# Altium schematic sheet power2pix.SchDoc
size A4
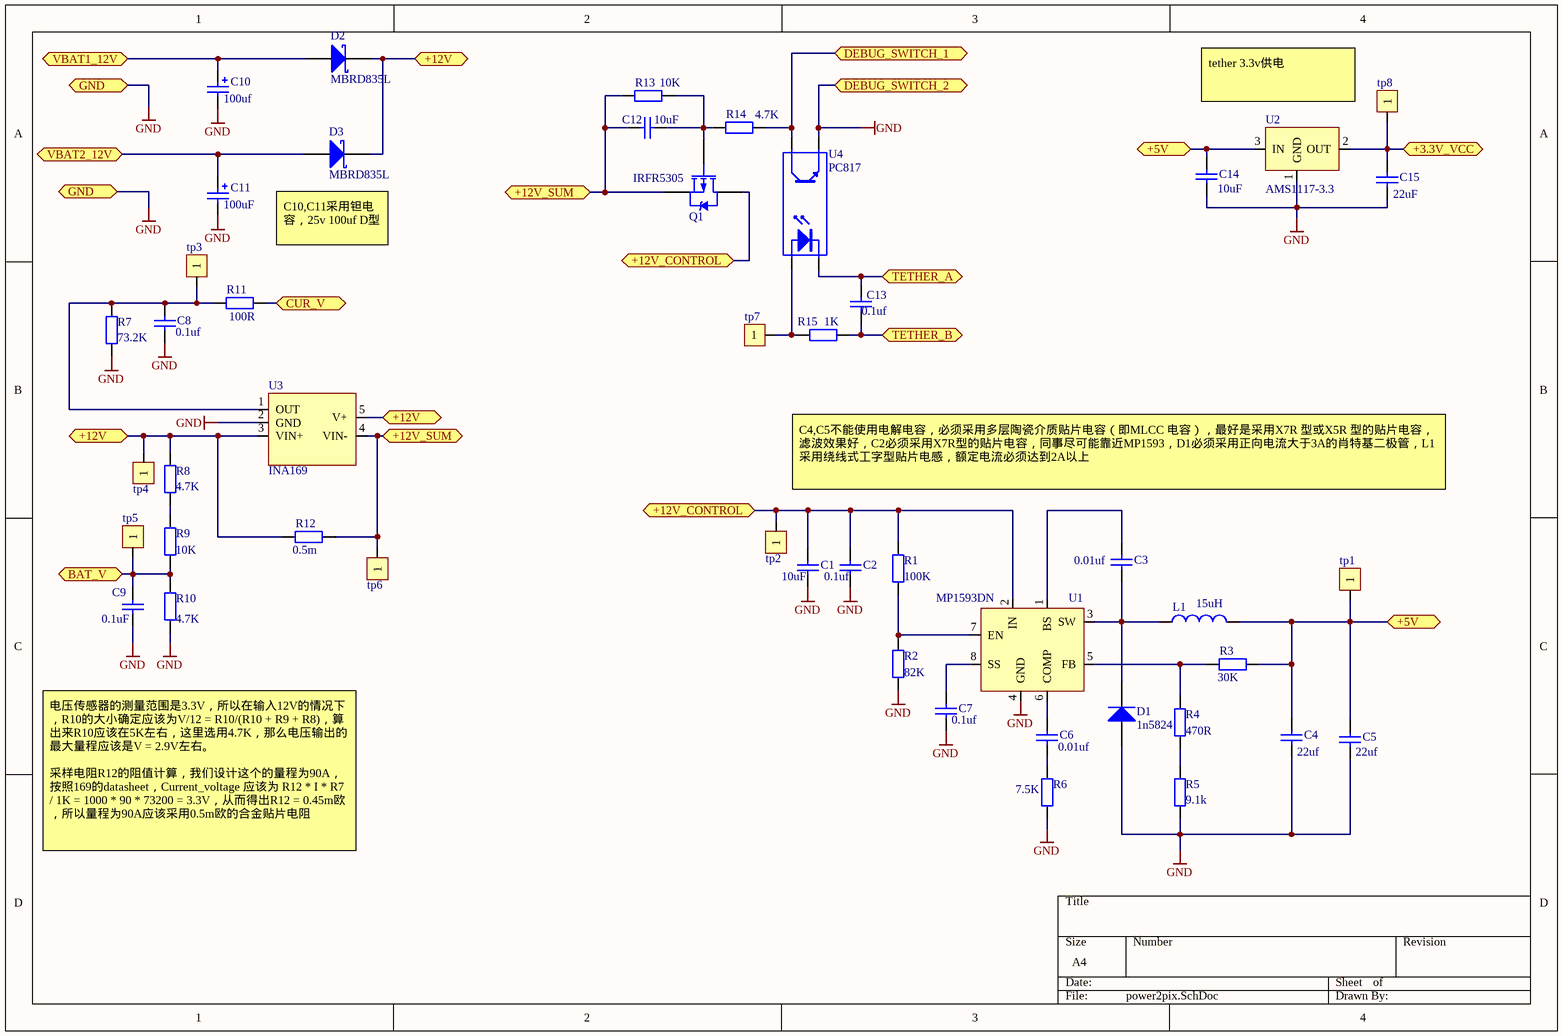
[diagram p0: power2pix.SchDoc]

## Parts
C1  value 10uF  [C1206]  (hidden comment: Cap)
C2  value 0.1uf  [6-0805_M]  (hidden comment: Cap)
C3  value 0.01uf  [0603]  (hidden comment: Cap)
C4  value 22uf  [C1206]  (hidden comment: Cap)
C5  value 22uf  [C1206]  (hidden comment: Cap)
C6  value 0.01uf  [0603]  (hidden comment: Cap)
C7  value 0.1uf  [6-0805_M]  (hidden comment: Cap)
C8  value 0.1uf  [6-0805_M]  (hidden comment: Cap)
C9  value 0.1uF  [6-0805_M]  (hidden comment: Cap)
C10  value 100uf  [7343]  (hidden comment: Cap Pol2)
C11  value 100uF  [7343]  (hidden comment: Cap Pol2)
C12  value 10uF  [C1206]  (hidden comment: Cap)
C13  value 0.1uf  [6-0805_M]  (hidden comment: Cap)
C14  value 10uF  [1206]  (hidden comment: Cap)
C15  value 22uF  [my0603]  (hidden comment: Cap)
D1  1n5824  [1N5824]
D2  MBRD835L  [MBRD835L]
D3  MBRD835L  [MBRD835L]
L1  value 15uH  [0630]  (hidden comment: Inductor)
Q1  IRFR5305  [TO-252AA]
R1  value 100K  [6-0805_M]  (hidden comment: Res2)
R2  value 82K  [6-0805_M]  (hidden comment: Res2)
R3  value 30K  [6-0805_M]  (hidden comment: Res2)
R4  value 470R  [6-0805_M]  (hidden comment: Res2)
R5  value 9.1k  [6-0805_M]  (hidden comment: Res2)
R6  value 7.5K  [6-0805_M]  (hidden comment: Res2)
R7  value 73.2K  [my0603]  (hidden comment: Res2)
R8  value 4.7K  [6-0805_M]  (hidden comment: Res2)
R9  value 10K  [6-0805_M]  (hidden comment: Res2)
R10  value 4.7K  [6-0805_M]  (hidden comment: Res2)
R11  value 100R  [6-0805_M]  (hidden comment: Res2)
R12  value 0.5m  [2512]  (hidden comment: Res2)
R13  value 10K  [6-0805_M]  (hidden comment: Res2)
R14  value 4.7K  [6-0805_M]  (hidden comment: Res2)
R15  value 1K  [6-0805_M]  (hidden comment: Res2)
tp1  tp  [testpoint]  (value not drawn)
tp2  tp  [testpoint]  (value not drawn)
tp3  tp  [testpoint]  (value not drawn)
tp4  tp  [testpoint]  (value not drawn)
tp5  tp  [testpoint]  (value not drawn)
tp6  tp  [testpoint]  (value not drawn)
tp7  tp  [testpoint]  (value not drawn)
tp8  tp  [testpoint]  (value not drawn)
U1  MP1593DN  [SO8_M]
U2  AMS1117-3.3  [SOT223_M]
U3  INA169  [SOT23-5]
U4  PC817  [DIP-4]

## Ports
+3.3V_VCC, +5V, +12V, +12V_CONTROL, +12V_SUM, BAT_V, CUR_V, DEBUG_SWITCH_1, DEBUG_SWITCH_2, GND, TETHER_A, TETHER_B, VBAT1_12V, VBAT2_12V

## Nets
GND: C1.1 C2.1 C4.1 C5.1 C7.1 C8.1 C9.1 C10.2 C11.2 C14.1 C15.1 D1.1(A) R2.1 R5.1 R6.1 R7.1 R10.1 U1.4(GND) U2.1(GND) U3.2(GND) U4.3(E) ; port GND, port DEBUG_SWITCH_2
+3.3V_VCC: C15.2 tp8.1 U2.2(OUT) ; port +3.3V_VCC
+5V: C4.2 C5.2 C14.2 L1.2 R3.1 tp1.1 U2.3(IN) ; port +5V
+12V: D2.2(K) D3.2(K) R8.2 R12.1 tp4.1 U3.3(VIN+) U3.5(V+) ; port +12V
+12V_CONTROL: C1.2 C2.2 Q1.4(D) R1.2 tp2.1 U1.2(IN) ; port +12V_CONTROL
+12V_SUM: C12.1 Q1.3(S) R12.2 R13.1 tp6.1 U3.4(VIN-) ; port +12V_SUM
BAT_V: C9.2 R9.1 R10.2 tp5.1 ; port BAT_V
CUR_V: R11.2 ; port CUR_V
DEBUG_SWITCH_1: R14.2 U4.4(C) ; port DEBUG_SWITCH_1
TETHER_A: C13.2 U4.2(K) ; port TETHER_A
TETHER_B: C13.1 R15.2 ; port TETHER_B
VBAT1_12V: C10.1 D2.1(A) ; port VBAT1_12V
VBAT2_12V: C11.1 D3.1(A) ; port VBAT2_12V
NetC3_1: C3.1 D1.2(K) L1.1 U1.3(SW)
NetC3_2: C3.2 U1.1(BS)
NetC6_1: C6.1 R6.2
NetC6_2: C6.2 U1.6(COMP)
NetC7_2: C7.2 U1.8(SS)
NetC8_2: C8.2 R7.2 R11.1 tp3.1 U3.1(OUT)
NetC12_2: C12.2 Q1.1(G) R13.2 R14.1
NetR1_1: R1.1 R2.2 U1.7(EN)
NetR3_2: R3.2 R4.2 U1.5(FB)
NetR4_1: R4.1 R5.2
NetR8_1: R8.1 R9.2
NetR15_1: R15.1 tp7.1 U4.1(A)

## Notes on the sheet
- tether 3.3v供电
- C10,C11采用钽电容，25v 100uf D型
- C4,C5不能使用电解电容，必须采用多层陶瓷介质贴片电容（即MLCC 电容），最好是采用X7R 型或X5R 型的贴片电容，滤波效果好，C2必须采用X7R型的贴片电容，同事尽可能靠近MP1593，D1必须采用正向电流大于3A的肖特基二极管，L1采用绕线式工字型贴片电感，额定电流必须达到2A以上
- 电压传感器的测量范围是3.3V，所以在输入12V的情况下，R10的大小确定应该为V/12 = R10/(R10 + R9 + R8)，算出来R10应该在5K左右，这里选用4.7K，那么电压输出的最大量程应该是V = 2.9V左右。
  采样电阻R12的阻值计算，我们设计这个的量程为90A，按照169的datasheet，Current_voltage 应该为 R12 * I * R7 / 1K = 1000 * 90 * 73200 = 3.3V，从而得出R12 = 0.45m欧，所以量程为90A应该采用0.5m欧的合金贴片电阻

## Library data of the parts
C1-C9 C12-C15 = Cap: Capacitor; Published: 8-Jun-2000; LatestRevisionDate: 17-Jul-2002; LatestRevisionNote: Re-released for DXP Platform.; PackageReference: RAD-0.3; Publisher: Altium Limited; PackageDescription: Radial Cap, Thru-Hole; 2 Leads; 0.3 in Pin Spacing
C10 C11 = Cap Pol2: Polarized Capacitor (Axial); Published: 8-Jun-2000; LatestRevisionDate: 17-Jul-2002; LatestRevisionNote: Re-released for DXP Platform.; PackageReference: POLAR0.8; Publisher: Altium Limited; PackageDescription: Polarized Capacitor; 2 Leads
D1 = Diode: Default Diode; Published: 8-Jun-2000; LatestRevisionDate: 17-Jul-2002; LatestRevisionNote: Re-released for DXP Platform.; PackageVersion: Sep-1996; PackageReference: SMC; Publisher: Altium Limited; PackageDescription: DO-214-AB/SMC; 2 C-Bend Leads; Body 7.9 x 5.9 mm, inc. leads (LxW); Code_JEDEC: DO-214-AB
D2 D3 = Diode 11DQ03: Schottky Rectifier; Published: 8-Jun-2000; LatestRevisionDate: 17-Jul-2002; LatestRevisionNote: Re-released for DXP Platform.; DatasheetVersion: Dec-1997; PackageReference: DO-204AL; Publisher: Altium Limited; PackageDescription: Diode, Axial; Body 5.2 x 2.7 mm (LxDia. max), Lead Dia. 0.86 mm (max); Code_JEDEC: DO-204-AL; ComponentLink1Description: Manufacturer Link; ComponentLink1URL: http://www.irf.com/; ComponentLink2Description: Datasheet; ComponentLink2URL: http://www.irf.com/product-info/datasheets/data/11dq03.pdf
L1 = Inductor: Code_IEC: 1005; Published: 8-Jun-2000; LatestRevisionDate: 29-May-2009; LatestRevisionNote: IPC-7351 Footprint Added.; PackageReference: 0402-A; Publisher: Altium Limited; PackageDescription: Chip Inductor; Code_JEITA: 0402
Q1 = PMOS-2: P-Channel Power MOSFET; Note: Pin 4 not drawn and electrically connected to Pin 2.; Published: 8-Jun-2000; LatestRevisionDate: 17-Jul-2002; LatestRevisionNote: Re-released for DXP Platform.; DatasheetVersion: PD-9.390D; PackageVersion: Feb-1997; PackageReference: TO-220AB; Publisher: Altium Limited; PackageDescription: TO, Thru-Hole, Vertical, Heatsink Mounted; 3 In-Line Leads; Pitch 2.54 mm; ComponentLink1Description: Manufacturer Link; ComponentLink1URL: http://www.irf.com/
R1-R15 = Res2: Resistor; Published: 8-Jun-2000; LatestRevisionDate: 17-Jul-2002; LatestRevisionNote: Re-released for DXP Platform.; PackageReference: AXIAL-0.4; Publisher: Altium Limited; PackageDescription: Axial Device, Thru-Hole; 2 Leads; 0.4 in Pin Spacing
U4 = Optoisolator1: 4-Pin Phototransistor Optocoupler; Published: 24-Mar-1999; LatestRevisionDate: 04-Mar-2005; LatestRevisionNote: Sch pins 3 & 4 Swapped.; DatasheetVersion: Nov-2003; PackageReference: DIP-4; Publisher: Altium Limited